# Altium schematic sheet 蓝牙和数据.SchDoc
size A4; SheetNumber: 2; SheetTotal: 3
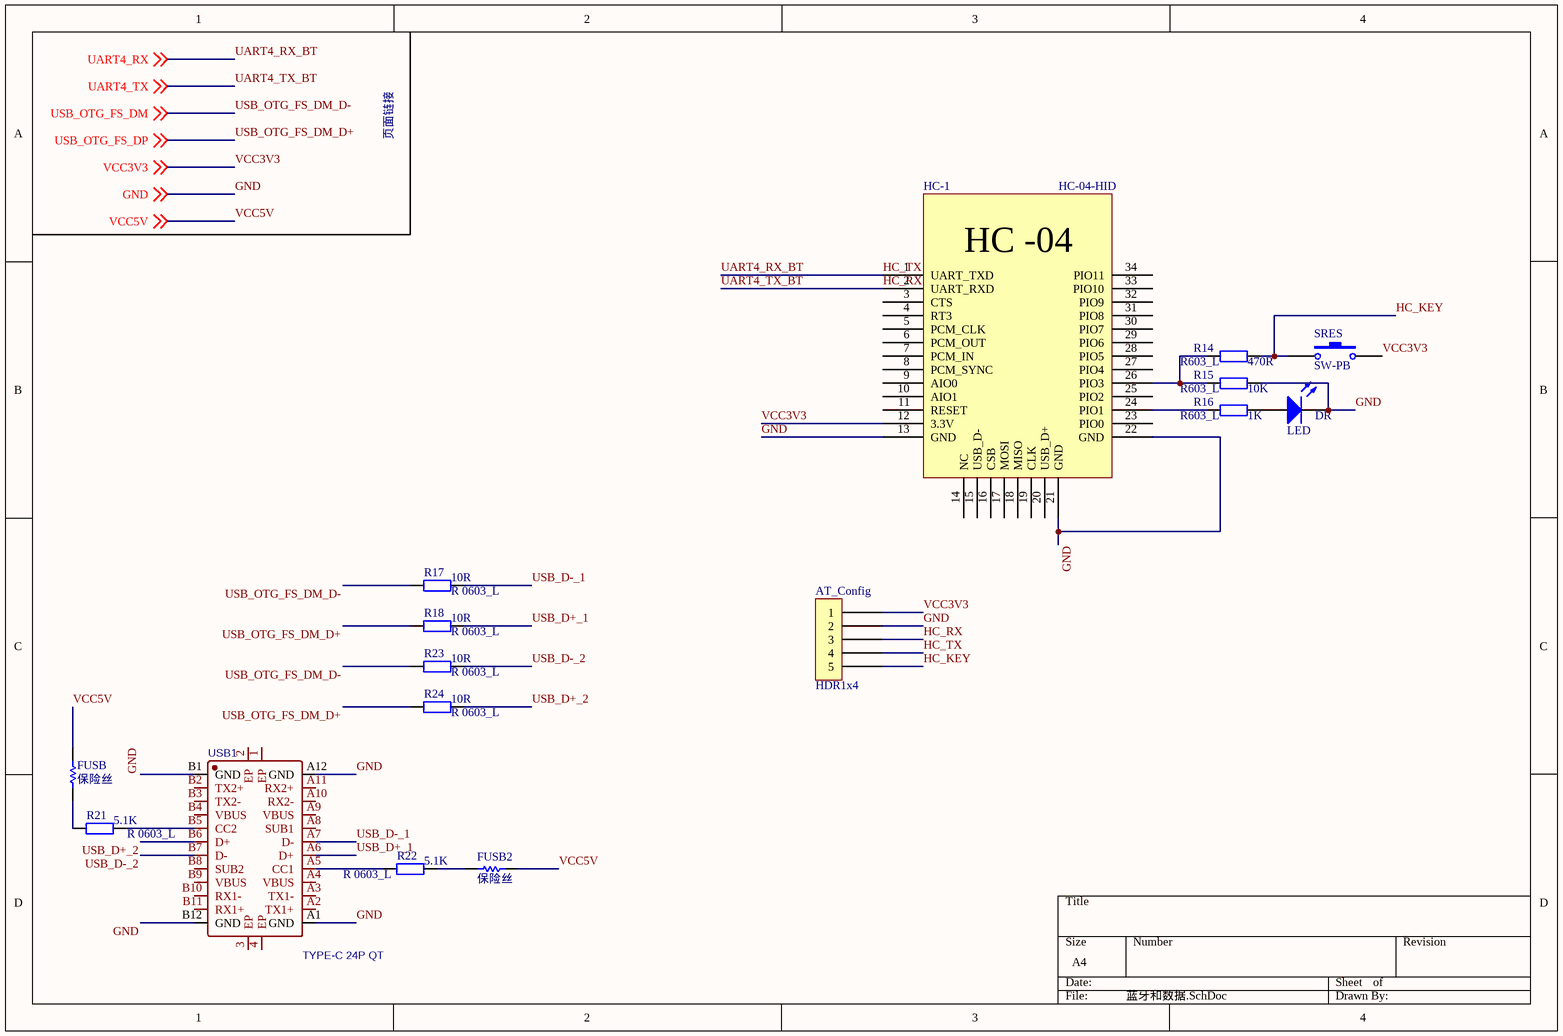
[diagram p0: 蓝牙和数据.SchDoc]

## Parts
AT_Config  HDR1x4  [MX 1.25-WS-5P]
DR  LED  [LED 0805R]
FUSB  保险丝  [FU 1206]
FUSB2  保险丝  [FU 1206]
HC-1  HC-04-HID  [HC-04]
R14  R603_L  value 470R  [R 0603_L]
R15  R603_L  value 10K  [R 0603_L]
R16  R603_L  value 1K  [R 0603_L]
R17  R 0603_L  value 10R  [R 0603_L]
R18  R 0603_L  value 10R  [R 0603_L]
R21  R 0603_L  value 5.1K  [R 0603_L]
R22  R 0603_L  value 5.1K  [R 0603_L]
R23  R 0603_L  value 10R  [R 0603_L]
R24  R 0603_L  value 10R  [R 0603_L]
SRES  SW-PB  [SMD-3.2*4.2]
USB1  TYPE-C 24P QT  [USB-C-SMD_TYPE-C-24P-QT]

## Nets
GND: AT_Config.2 DR.2(K) HC-1.13(GND) HC-1.21(GND) HC-1.22(GND) R15.2 USB1.A1(GND) USB1.A12(GND) USB1.B1(GND) USB1.B12(GND) ; off-sheet GND
HC_KEY: AT_Config.5 R14.2 SRES.1
HC_RX: AT_Config.3 HC-1.2(UART_RXD) ; off-sheet UART4_TX  [also labelled UART4_TX, UART4_TX_BT]
HC_TX: AT_Config.4 HC-1.1(UART_TXD) ; off-sheet UART4_RX  [also labelled UART4_RX, UART4_RX_BT]
USB_D+_1: R18.2 USB1.A6(D+)
USB_D+_2: R24.2 USB1.B6(D+)
USB_D-_1: R17.2 USB1.A7(D-)
USB_D-_2: R23.2 USB1.B7(D-)
USB_OTG_FS_DM_D+: R18.1 R24.1 ; off-sheet USB_OTG_FS_DP  [also labelled USB_OTG_FS_DP]
USB_OTG_FS_DM_D-: R17.1 R23.1 ; off-sheet USB_OTG_FS_DM  [also labelled USB_OTG_FS_DM]
VCC3V3: AT_Config.1 HC-1.12(3.3V) SRES.2 ; off-sheet VCC3V3
VCC5V: FUSB.1 FUSB2.2 ; off-sheet VCC5V
NetDR_1: DR.1(A) R16.2
NetFUSB2_1: FUSB2.1 R22.2
NetFUSB_2: FUSB.2 R21.1
NetHC-1_24: HC-1.24(PIO1) R16.1
NetHC-1_26: HC-1.26(PIO3) R14.1 R15.1
NetR21_2: R21.2 USB1.B5(CC2)
NetR22_1: R22.1 USB1.A5(CC1)

Not connected (* = marked no-connect by the designer): HC-1 3(CTS) 4(RT3) 5(PCM_CLK) 6(PCM_OUT) 7(PCM_IN) 8(PCM_SYNC) 9(AIO0) 10(AIO1) 11(RESET) 14(NC) 15(USB_D-) 16(CSB) 17(MOSI) 18(MISO) 19(CLK) 20(USB_D+) 23(PIO0) 25(PIO2) 27(PIO4) 28(PIO5) 29(PIO6) 30(PIO7) 31(PIO8) 32(PIO9) 33(PIO10) 34(PIO11); USB1 1(EP) 2(EP) 3(EP) 4(EP) A2(TX1+) A3(TX1-) A4(VBUS) A8(SUB1) A9(VBUS) A10(RX2-) A11(RX2+) B2(TX2+) B3(TX2-) B4(VBUS) B8(SUB2) B9(VBUS) B10(RX1-) B11(RX1+)

## Notes on the sheet
- 页面链接
- (in symbol HC-04) HC -04

## Library data of the parts
AT_Config = HDR1x5_卧
DR = LED 0805R 红: Typical INFRARED GaAs LED; Published: 8-Jun-2000; LatestRevisionDate: 08-Jul-2005; LatestRevisionNote: Mech Layer 1 removed.; PackageReference: LED-0; Publisher: Altium Limited; PackageDescription: LED; 2 Leads
FUSB FUSB2 = FU: Published: 8-Jun-2000; LatestRevisionDate: 17-Jul-2002; LatestRevisionNote: Re-released for DXP Platform.; PackageReference: AXIAL-0.3; Publisher: Altium Limited; PackageDescription: Axial Device, Thru-Hole; 2 Leads; 0.3 in Pin Spacing
HC-1 = HC-04
R14-R18 R21-R24 = R 0603_L: Resistor; Published: 8-Jun-2000; LatestRevisionDate: 17-Jul-2002; LatestRevisionNote: Re-released for DXP Platform.; PackageReference: AXIAL-0.4; Publisher: Altium Limited; PackageDescription: Axial Device, Thru-Hole; 2 Leads; 0.4 in Pin Spacing
SRES = SW-PB: Switch; Published: 24-Mar-1999; LatestRevisionDate: 17-Jul-2002; LatestRevisionNote: Re-released for DXP Platform.; PackageReference: SPST-2; Publisher: Altium Limited; PackageDescription: Switch; 2 Leads
USB1 = TYPE-C 24P QT: BOM_Manufacturer: SHOU HAN(首韩); Contributor: LCSC; BOM_Supplier: LCSC; BOM_Supplier Part: C2681555; BOM_Manufacturer Part: TYPE-C 24P QT; BOM_JLCPCB Part Class: Extended Part; spicePre: U; spiceSymbolName: TYPE-C 24P QT